# EAGLE design MDmotherboard (EAGLE 9.6.2)
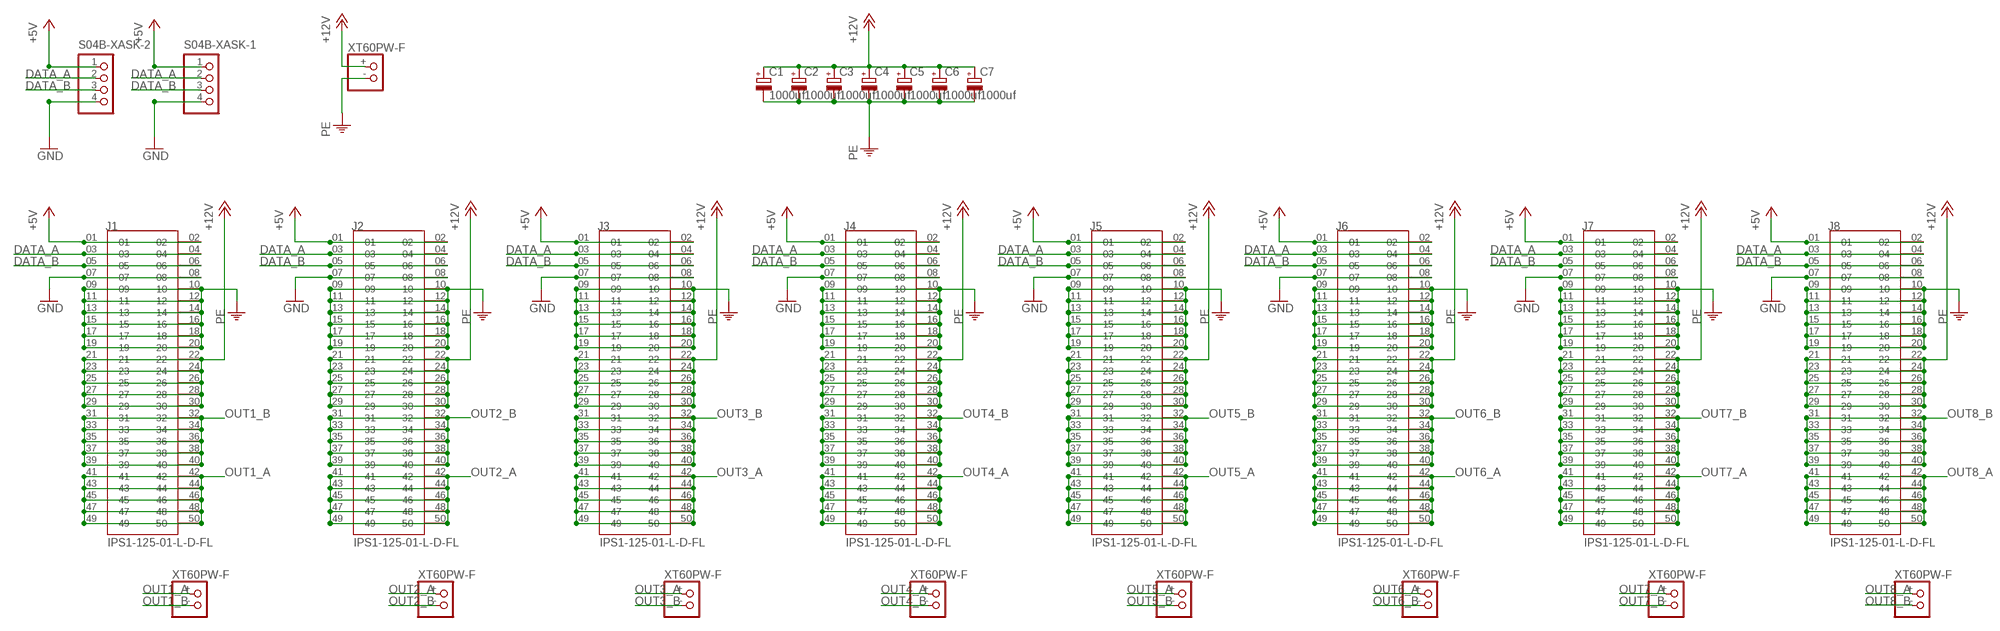
[diagram p0: schematic, sheet 1]

## Parts
C1  1000uf  CPOL-EUE3.5-10  [E3,5-10]
C2  1000uf  CPOL-EUE3.5-10  [E3,5-10]
C3  1000uf  CPOL-EUE3.5-10  [E3,5-10]
C4  1000uf  CPOL-EUE3.5-10  [E3,5-10]
C5  1000uf  CPOL-EUE3.5-10  [E3,5-10]
C6  1000uf  CPOL-EUE3.5-10  [E3,5-10]
C7  1000uf  CPOL-EUE3.5-10  [E3,5-10]
J1  IPS1-125-01-L-D-FL  [SAMTEC_IPS1-125-01-L-D-FL]
J2  IPS1-125-01-L-D-FL  [SAMTEC_IPS1-125-01-L-D-FL]
J3  IPS1-125-01-L-D-FL  [SAMTEC_IPS1-125-01-L-D-FL]
J4  IPS1-125-01-L-D-FL  [SAMTEC_IPS1-125-01-L-D-FL]
J5  IPS1-125-01-L-D-FL  [SAMTEC_IPS1-125-01-L-D-FL]
J6  IPS1-125-01-L-D-FL  [SAMTEC_IPS1-125-01-L-D-FL]
J7  IPS1-125-01-L-D-FL  [SAMTEC_IPS1-125-01-L-D-FL]
J8  IPS1-125-01-L-D-FL  [SAMTEC_IPS1-125-01-L-D-FL]
S04B-XASK-1  S4B-XASK-1  [S4B-XASK-1]
S04B-XASK-2  S4B-XASK-1  [S4B-XASK-1]
U$1  XT60PW-F  [XT60PW-F]
U$2  XT60PW-F  [XT60PW-F]
U$3  XT60PW-F  [XT60PW-F]
U$4  XT60PW-F  [XT60PW-F]
U$5  XT60PW-F  [XT60PW-F]
U$6  XT60PW-F  [XT60PW-F]
U$7  XT60PW-F  [XT60PW-F]
U$8  XT60PW-F  [XT60PW-F]
U$9  XT60PW-F  [XT60PW-F]

## Nets
+5V: J1.01 J1.02 J2.01 J2.02 J3.01 J3.02 J4.01 J4.02 J5.01 J5.02 J6.01 J6.02 J7.01 J7.02 J8.01 J8.02 S04B-XASK-1.1 S04B-XASK-2.1
+12V: C1.+ C2.+ C3.+ C4.+ C5.+ C6.+ C7.+ J1.21 J1.22 J1.23 J1.24 J1.25 J1.26 J1.27 J1.28 J1.29 J1.30 J2.21 J2.22 J2.23 J2.24 J2.25 J2.26 J2.27 J2.28 J2.29 J2.30 J3.21 J3.22 J3.23 J3.24 J3.25 J3.26 J3.27 J3.28 J3.29 J3.30 J4.21 J4.22 J4.23 J4.24 J4.25 J4.26 J4.27 J4.28 J4.29 J4.30 J5.21 J5.22 J5.23 J5.24 J5.25 J5.26 J5.27 J5.28 J5.29 J5.30 J6.21 J6.22 J6.23 J6.24 J6.25 J6.26 J6.27 J6.28 J6.29 J6.30 J7.21 J7.22 J7.23 J7.24 J7.25 J7.26 J7.27 J7.28 J7.29 J7.30 J8.21 J8.22 J8.23 J8.24 J8.25 J8.26 J8.27 J8.28 J8.29 J8.30 U$1.+
DATA_A: J1.03 J1.04 J2.03 J2.04 J3.03 J3.04 J4.03 J4.04 J5.03 J5.04 J6.03 J6.04 J7.03 J7.04 J8.03 J8.04 S04B-XASK-1.2 S04B-XASK-2.2
DATA_B: J1.05 J1.06 J2.05 J2.06 J3.05 J3.06 J4.05 J4.06 J5.05 J5.06 J6.05 J6.06 J7.05 J7.06 J8.05 J8.06 S04B-XASK-1.3 S04B-XASK-2.3
GND: J1.07 J1.08 J2.07 J2.08 J3.07 J3.08 J4.07 J4.08 J5.07 J5.08 J6.07 J6.08 J7.07 J7.08 J8.07 J8.08 S04B-XASK-1.4 S04B-XASK-2.4
OUT1_A: J1.41 J1.42 J1.43 J1.44 J1.45 J1.46 J1.47 J1.48 J1.49 J1.50 U$2.+
OUT1_B: J1.31 J1.32 J1.33 J1.34 J1.35 J1.36 J1.37 J1.38 J1.39 J1.40 U$2.-
OUT2_A: J2.41 J2.42 J2.43 J2.44 J2.45 J2.46 J2.47 J2.48 J2.49 J2.50 U$3.+
OUT2_B: J2.31 J2.32 J2.33 J2.34 J2.35 J2.36 J2.37 J2.38 J2.39 J2.40 U$3.-
OUT3_A: J3.41 J3.42 J3.43 J3.44 J3.45 J3.46 J3.47 J3.48 J3.49 J3.50 U$4.+
OUT3_B: J3.31 J3.32 J3.33 J3.34 J3.35 J3.36 J3.37 J3.38 J3.39 J3.40 U$4.-
OUT4_A: J4.41 J4.42 J4.43 J4.44 J4.45 J4.46 J4.47 J4.48 J4.49 J4.50 U$5.+
OUT4_B: J4.31 J4.32 J4.33 J4.34 J4.35 J4.36 J4.37 J4.38 J4.39 J4.40 U$5.-
OUT5_A: J5.41 J5.42 J5.43 J5.44 J5.45 J5.46 J5.47 J5.48 J5.49 J5.50 U$6.+
OUT5_B: J5.31 J5.32 J5.33 J5.34 J5.35 J5.36 J5.37 J5.38 J5.39 J5.40 U$6.-
OUT6_A: J6.41 J6.42 J6.43 J6.44 J6.45 J6.46 J6.47 J6.48 J6.49 J6.50 U$7.+
OUT6_B: J6.31 J6.32 J6.33 J6.34 J6.35 J6.36 J6.37 J6.38 J6.39 J6.40 U$7.-
OUT7_A: J7.41 J7.42 J7.43 J7.44 J7.45 J7.46 J7.47 J7.48 J7.49 J7.50 U$8.+
OUT7_B: J7.31 J7.32 J7.33 J7.34 J7.35 J7.36 J7.37 J7.38 J7.39 J7.40 U$8.-
OUT8_A: J8.41 J8.42 J8.43 J8.44 J8.45 J8.46 J8.47 J8.48 J8.49 J8.50 U$9.+
OUT8_B: J8.31 J8.32 J8.33 J8.34 J8.35 J8.36 J8.37 J8.38 J8.39 J8.40 U$9.-
PE: C1.- C2.- C3.- C4.- C5.- C6.- C7.- J1.09 J1.10 J1.11 J1.12 J1.13 J1.14 J1.15 J1.16 J1.17 J1.18 J1.19 J1.20 J2.09 J2.10 J2.11 J2.12 J2.13 J2.14 J2.15 J2.16 J2.17 J2.18 J2.19 J2.20 J3.09 J3.10 J3.11 J3.12 J3.13 J3.14 J3.15 J3.16 J3.17 J3.18 J3.19 J3.20 J4.09 J4.10 J4.11 J4.12 J4.13 J4.14 J4.15 J4.16 J4.17 J4.18 J4.19 J4.20 J5.09 J5.10 J5.11 J5.12 J5.13 J5.14 J5.15 J5.16 J5.17 J5.18 J5.19 J5.20 J6.09 J6.10 J6.11 J6.12 J6.13 J6.14 J6.15 J6.16 J6.17 J6.18 J6.19 J6.20 J7.09 J7.10 J7.11 J7.12 J7.13 J7.14 J7.15 J7.16 J7.17 J7.18 J7.19 J7.20 J8.09 J8.10 J8.11 J8.12 J8.13 J8.14 J8.15 J8.16 J8.17 J8.18 J8.19 J8.20 U$1.-

## Library data of the parts
C1-C7 = rcl:CPOL-EU: POLARIZED CAPACITOR, European symbol; SPICEPREFIX: C
J1-J8 = IPS1-125-01-L-D-FL:IPS1-125-01-L-D-FL: Check availability <https://pricing.snapeda.com/parts/IPS1-125-01-L-D-FL/Samtec%20Inc./view-part?ref=eda>; AVAILABILITY: In Stock; DESCRIPTION: 50 Position Receptacle Connector 0.100 (2.54mm) Through Hole Gold; MF: Samtec Inc.; MP: IPS1-125-01-L-D-FL; PACKAGE: None; PRICE: None; PURCHASE-URL: https://pricing.snapeda.com/search/part/IPS1-125-01-L-D-FL/?ref=eda
S04B-XASK-1 S04B-XASK-2 = XAconnecter:S4B-XASK-1: Wire-to-Board 2.5mm pitch top mount connector Source: http://www.jst-mfg.com/product/pdf/jpn/XA1.pdf http://www.jst-mfg.com/product/detail.php?series=272
U$1-U$9 = XT60_s:XT60PW-F

## Board
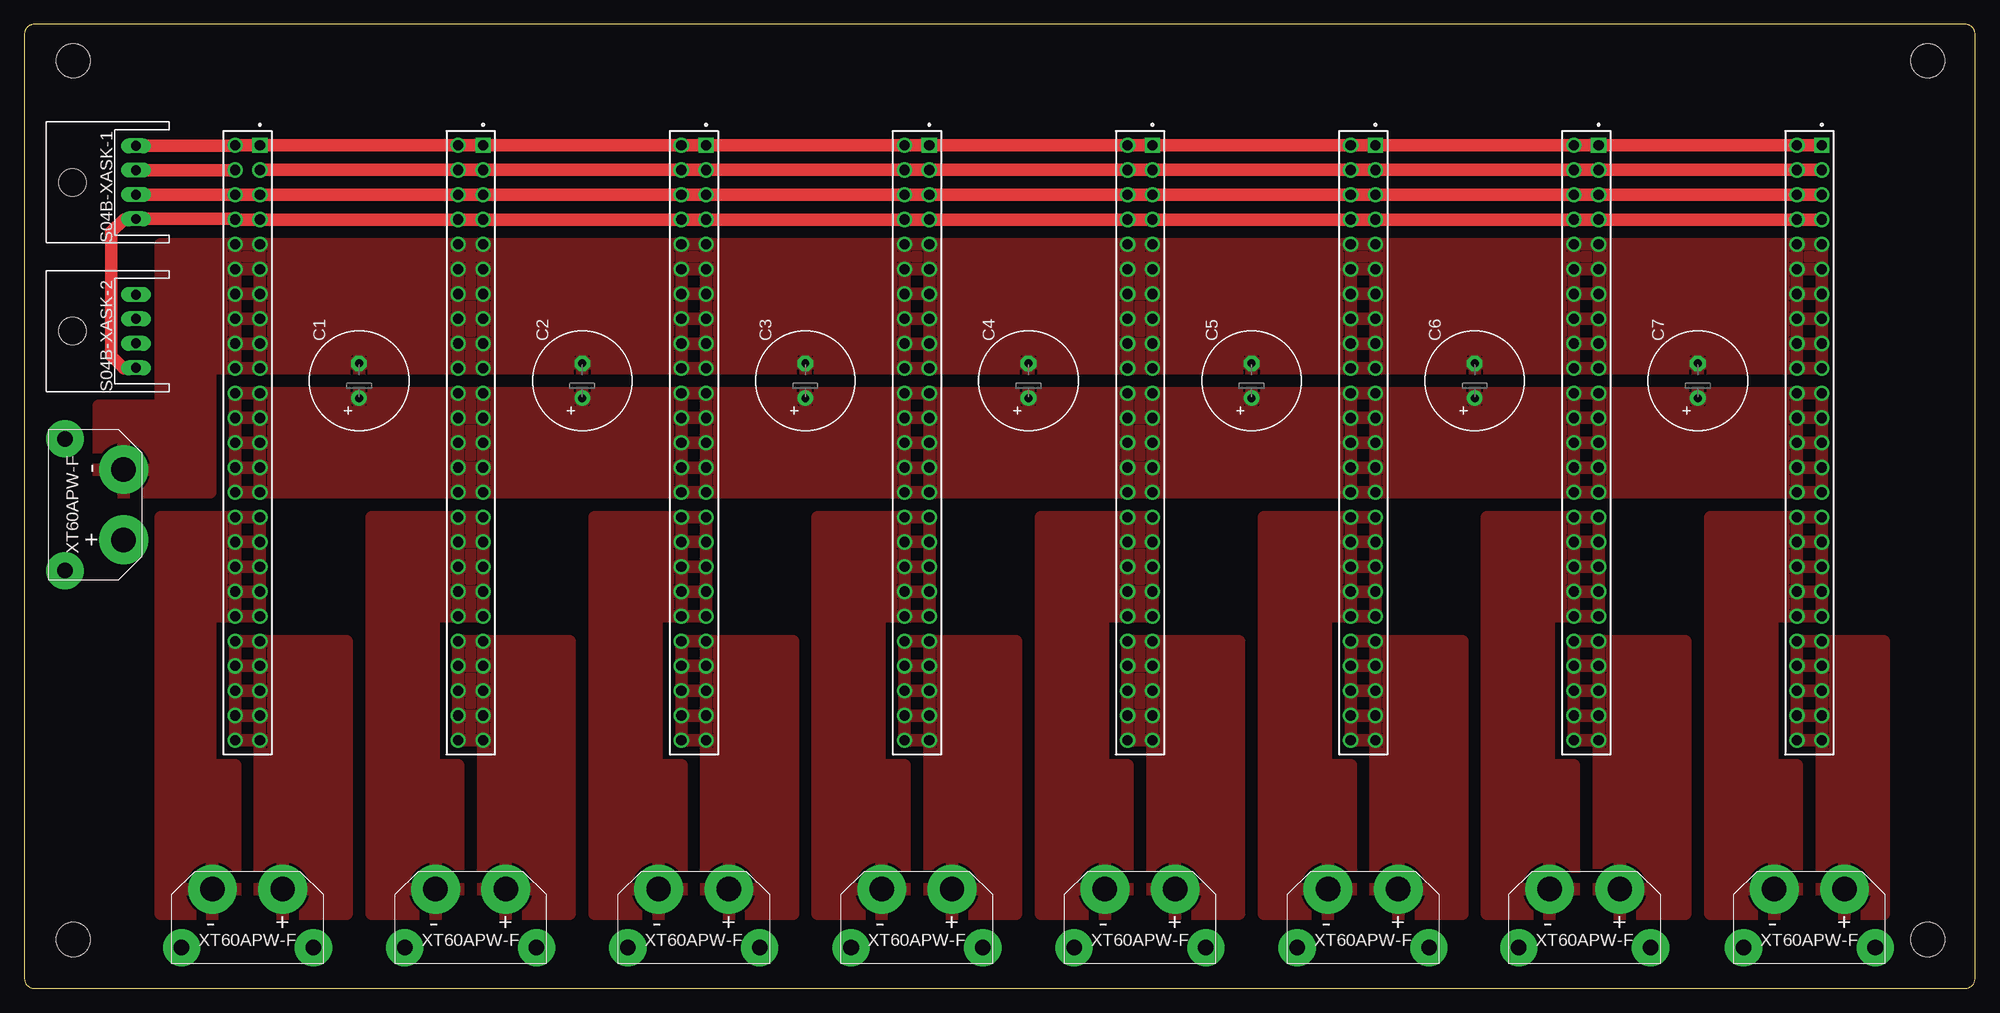
[diagram p1: board, top side]
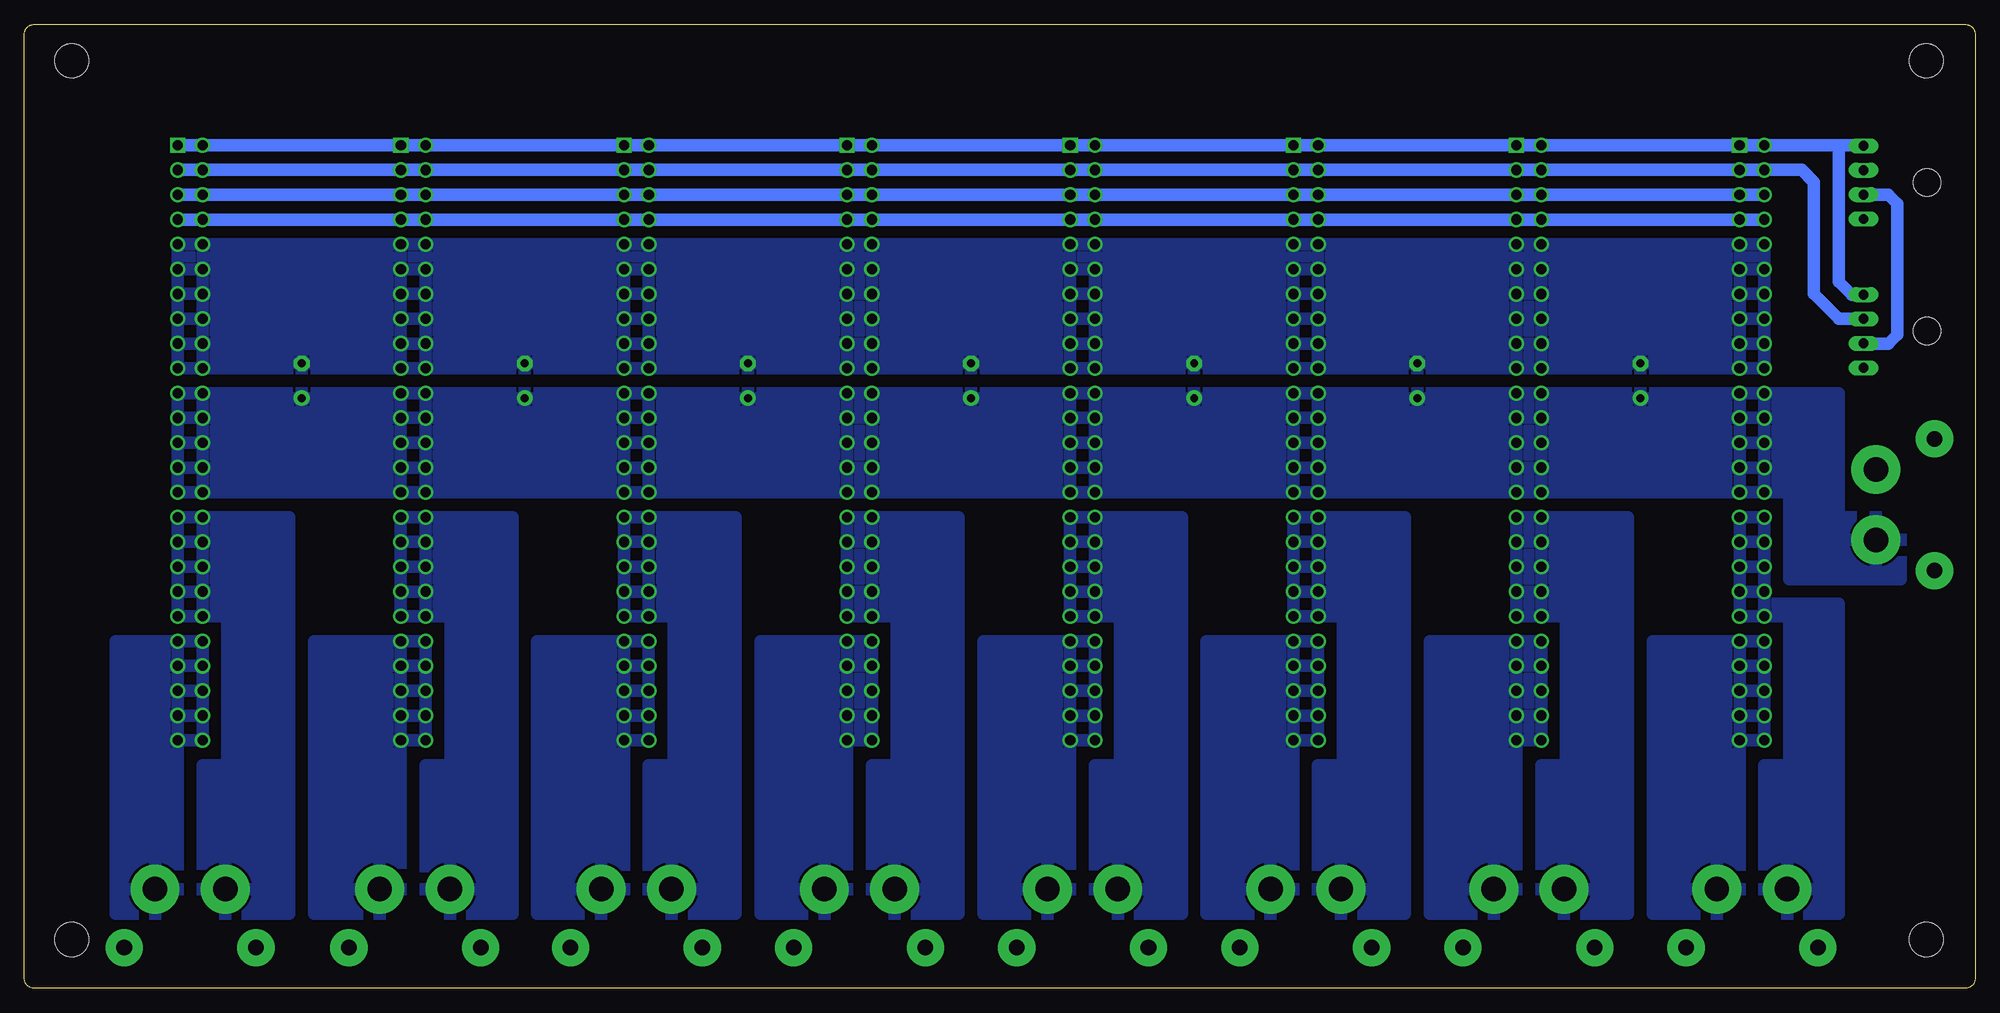
[diagram p2: board, bottom side, seen from below]

Size 199.86 x 98.73 mm. Coordinates in mm from the lower left corner, seen from the top.
Outline: 199.86,1 199.86,97.73 arc90 198.86,98.73 1,98.73 arc90 0,97.73 0,1 arc90 1,0 198.86,0 arc90 199.86,1
Copper layers (1*16): Top 0.035mm / dielectric 1.5mm / Bottom 0.035mm
Design rules "default": minimum track width 6mil, minimum drill 0.35mm, track to track 6mil, track to pad 6mil, pad to pad 6mil, via to via 6mil, smd to smd 6mil, copper to edge 40mil, drill to drill 6mil, minimum pad ring 10mil, minimum via ring 8mil, stop-mask expansion 4mil, vias tented up to drill 0mil, thermal gap 10mil
Holes 3.5 mm at 5,5 5,95 195,5 195,95

### Footprints (pad centres in the part's own frame; a part is rotated, then mirrored left to right if it is on the bottom)
E3,5-10 = drill 0.813 pad 1.6: + -1.778,0 | drill 0.813 pad 1.6 octagon: - 1.778,0
SAMTEC_IPS1-125-01-L-D-FL = drill 1.04 pad 1.39 square: 01 30.48,-1.27 | drill 1.04 pad 1.39: 02 30.48,1.27; 03 27.94,-1.27; 04 27.94,1.27; 05 25.4,-1.27; 06 25.4,1.27; 07 22.86,-1.27; 08 22.86,1.27; 09 20.32,-1.27; 10 20.32,1.27; 11 17.78,-1.27; 12 17.78,1.27; 13 15.24,-1.27; 14 15.24,1.27; 15 12.7,-1.27; 16 12.7,1.27; 17 10.16,-1.27; 18 10.16,1.27; 19 7.62,-1.27; 20 7.62,1.27; 21 5.08,-1.27; 22 5.08,1.27; 23 2.54,-1.27; 24 2.54,1.27; 25 0,-1.27; 26 0,1.27; 27 -2.54,-1.27; 28 -2.54,1.27; 29 -5.08,-1.27; 30 -5.08,1.27; 31 -7.62,-1.27; 32 -7.62,1.27; 33 -10.16,-1.27; 34 -10.16,1.27; 35 -12.7,-1.27; 36 -12.7,1.27; 37 -15.24,-1.27; 38 -15.24,1.27; 39 -17.78,-1.27; 40 -17.78,1.27; 41 -20.32,-1.27; 42 -20.32,1.27; 43 -22.86,-1.27; 44 -22.86,1.27; 45 -25.4,-1.27; 46 -25.4,1.27; 47 -27.94,-1.27; 48 -27.94,1.27; 49 -30.48,-1.27; 50 -30.48,1.27
S4B-XASK-1 = drill 1.016 long: 1 3.75,0; 2 1.25,0; 3 -1.25,0; 4 -3.75,0 | hole 2.8: 0,6.5
XT60PW-F = drill 1.6 pad 3.81: 1 -6.75,6; 2 6.75,6 | drill 2.5 pad 5: + -3.6,0; - 3.6,0

### Placement (x,y rotation side)
C1  34.29,62.23 90 top
C2  57.15,62.23 90 top
C3  80.01,62.23 90 top
C4  102.87,62.23 90 top
C5  125.73,62.23 90 top
C6  148.59,62.23 90 top
C7  171.45,62.23 90 top
J1  22.86,55.88 90 top
J2  45.72,55.88 90 top
J3  68.58,55.88 90 top
J4  91.44,55.88 90 top
J5  114.3,55.88 90 top
J6  137.16,55.88 90 top
J7  160.02,55.88 90 top
J8  182.88,55.88 90 top
S04B-XASK-1  11.43,82.55 90 top
S04B-XASK-2  11.43,67.31 90 top
U$1  10.16,49.53 90 top
U$2  22.86,10.16 180 top
U$3  45.72,10.16 180 top
U$4  68.58,10.16 180 top
U$5  91.44,10.16 180 top
U$6  114.3,10.16 180 top
U$7  137.16,10.16 180 top
U$8  159.86,10.16 180 top
U$9  182.88,10.16 180 top

### Tracks (layer width: path | path; a pad name or v marks a point on that pad's centre or on a via)
+5V
  Top 1.27: J7.02 J8.01 J8.02 | J7.02 J6.02 | J6.02 J5.02 | J5.02 J4.02 | J4.02 J3.01 | J3.01 J2.01 J2.02 J1.01 J1.02 21.53,86.3 S04B-XASK-1.1 | J3.02 J3.01 | J7.01 J7.02 | J6.01 J6.02 | J5.01 J5.02 | J4.01 J4.02
  Bottom 1.27: 13.97,86.36 13.97,72.39 12.64,71.06 S04B-XASK-2.1 | J8.01 J1.02 13.97,86.36 | 13.97,86.36 11.43,86.36 S04B-XASK-1.1
+12V
  pour Top: 21.59,50.8 184.15,50.8 184.15,60.96 21.59,60.96
  pour Bottom: 21.59,60.96 13.97,60.96 13.97,49.53 13.97,48.26 7.62,48.26 7.62,41.91 19.05,41.91 19.05,50.8 184.15,50.8 184.15,60.96
DATA_A
  Top 1.27: J7.04 J8.03 J8.04 | J7.04 J6.04 | J6.04 J5.04 | J5.04 J4.04 | J4.04 J3.03 | J3.03 J2.03 J2.04 J1.03 | J1.04 21.57,83.8 S04B-XASK-1.2 | J3.04 J3.03 | J7.03 J7.04 | J6.03 J6.04 | J5.03 J5.04 | J4.03 J4.04
  Bottom 1.27: S04B-XASK-2.2 11.45,68.58 13.97,68.58 16.51,71.12 16.51,82.55 17.78,83.82 J1.04 J1.03 J8.03
DATA_B
  Top 1.27: J7.06 J8.05 J8.06 | J7.06 J6.06 | J6.06 J5.06 | J5.06 J4.06 | J4.06 J3.05 | J3.05 J2.05 J2.06 J1.05 J1.06 21.57,81.3 S04B-XASK-1.3 | J3.06 J3.05 | J7.05 J7.06 | J6.05 J6.06 | J5.05 J5.06 | J4.05 J4.06
  Bottom 1.27: S04B-XASK-2.3 11.41,66.04 8.89,66.04 7.98,66.95 7.98,80.37 8.91,81.3 S04B-XASK-1.3 | J8.05 J1.06
GND
  Top 1.27: J1.08 21.65,78.8 | J1.08 21.53,78.8 S04B-XASK-1.4 11.37,78.74 10.16,78.74 8.89,77.47 8.89,64.77 10.16,63.5 11.49,63.5 S04B-XASK-2.4 | J1.08 J1.07 J2.08 J2.07 J3.08 J3.07 J4.08 J4.07 J5.08 J5.07 J6.08 J6.07 J7.08 J7.07 J8.08 J8.07
  Bottom 1.27: J1.08 J8.07
OUT1_A
  pour Top: 24.13,7.62 33.02,7.62 33.02,35.56 21.59,35.56 21.59,25.4 24.13,25.4
  pour Bottom: 21.59,35.56 21.59,25.4 24.13,25.4 24.13,7.62 33.02,7.62 33.02,35.56
OUT1_B
  pour Top: 24.13,48.26 13.97,48.26 13.97,7.62 21.59,7.62 21.59,22.86 19.05,22.86 19.05,38.1 24.13,38.1
  pour Bottom: 21.59,48.26 24.13,48.26 24.13,38.1 19.05,38.1 19.05,22.86 21.59,22.86 21.59,7.62 13.97,7.62 13.97,39.37 21.59,39.37
OUT2_A
  pour Top: 44.45,35.56 44.45,25.4 46.99,25.4 46.99,7.62 55.88,7.62 55.88,34.29 55.88,35.56
  pour Bottom: 44.45,35.56 44.45,25.4 46.99,25.4 46.99,7.62 55.88,7.62 55.88,35.56
OUT2_B
  pour Top: 44.45,7.62 35.56,7.62 35.56,48.26 46.99,48.26 46.99,38.1 41.91,38.1 41.91,22.86 44.45,22.86
  pour Bottom: 46.99,38.1 41.91,38.1 41.91,22.86 44.45,22.86 44.45,7.62 35.56,7.62 35.56,48.26 46.99,48.26
OUT3_A
  pour Top: 67.31,35.56 67.31,25.4 69.85,25.4 69.85,7.62 78.74,7.62 78.74,35.56
  pour Bottom: 69.85,7.62 69.85,25.4 67.31,25.4 67.31,35.56 78.74,35.56 78.74,7.62
OUT3_B
  pour Top: 69.85,38.1 64.77,38.1 64.77,22.86 67.31,22.86 67.31,7.62 58.42,7.62 58.42,48.26 69.85,48.26
  pour Bottom: 67.31,7.62 67.31,22.86 64.77,22.86 64.77,38.1 69.85,38.1 69.85,48.26 58.42,48.26 58.42,7.62
OUT4_A
  pour Top: 90.17,35.56 90.17,25.4 92.71,25.4 92.71,7.62 101.6,7.62 101.6,35.56
  pour Bottom: 90.17,35.56 90.17,25.4 92.71,25.4 92.71,7.62 101.6,7.62 101.6,35.56
OUT4_B
  pour Top: 92.71,38.1 87.63,38.1 87.63,22.86 90.17,22.86 90.17,7.62 81.28,7.62 81.28,48.26 92.71,48.26
  pour Bottom: 92.71,38.1 87.63,38.1 87.63,22.86 90.17,22.86 90.17,7.62 81.28,7.62 81.28,48.26 92.71,48.26
OUT5_A
  pour Top: 113.03,35.56 113.03,25.4 115.57,25.4 115.57,7.62 124.46,7.62 124.46,35.56
  pour Bottom: 113.03,34.29 113.03,35.56 124.46,35.56 124.46,7.62 115.57,7.62 115.57,25.4 113.03,25.4
OUT5_B
  pour Top: 115.57,38.1 110.49,38.1 110.49,22.86 113.03,22.86 113.03,7.62 104.14,7.62 104.14,48.26 115.57,48.26
  pour Bottom: 115.57,38.1 110.49,38.1 110.49,22.86 113.03,22.86 113.03,7.62 104.14,7.62 104.14,48.26 115.57,48.26
OUT6_A
  pour Bottom: 138.43,25.4 135.89,25.4 135.89,35.56 147.32,35.56 147.32,7.62 138.43,7.62
  pour Top: 135.89,25.4 138.43,25.4 138.43,7.62 147.32,7.62 147.32,35.56 135.89,35.56
OUT6_B
  pour Bottom: 138.43,38.1 133.35,38.1 133.35,22.86 135.89,22.86 135.89,7.62 127,7.62 127,48.26 138.43,48.26
  pour Top: 138.43,48.26 127,48.26 127,7.62 135.89,7.62 135.89,22.86 133.35,22.86 133.35,38.1 138.43,38.1
OUT7_A
  pour Top: 158.75,35.56 158.75,25.4 161.29,25.4 161.29,7.62 170.18,7.62 170.18,35.56
  pour Bottom: 158.75,35.56 158.75,25.4 161.29,25.4 161.29,7.62 170.18,7.62 170.18,35.56
OUT7_B
  pour Top: 161.29,38.1 156.21,38.1 156.21,22.86 158.75,22.86 158.75,7.62 149.86,7.62 149.86,48.26 161.29,48.26
  pour Bottom: 161.29,38.1 156.21,38.1 156.21,22.86 158.75,22.86 158.75,7.62 149.86,7.62 149.86,48.26 161.29,48.26
OUT8_A
  pour Bottom: 181.61,35.56 181.61,25.4 184.15,25.4 184.15,7.62 190.5,7.62 190.5,35.56
  pour Top: 181.61,35.56 181.61,25.4 184.15,25.4 184.15,7.62 190.5,7.62 190.5,35.56
OUT8_B
  pour Bottom: 184.15,38.1 179.07,38.1 179.07,22.86 181.61,22.86 181.61,7.62 172.72,7.62 172.72,48.26 184.15,48.26
  pour Top: 184.15,38.1 179.07,38.1 179.07,22.86 181.61,22.86 181.61,7.62 172.72,7.62 172.72,48.26 184.15,48.26
PE
  pour Top: 21.59,63.5 184.15,63.5 184.15,73.66 184.15,76.2 21.59,76.2
  pour Top: 7.62,59.69 7.62,50.8 19.05,50.8 19.05,63.5 24.13,63.5 24.13,76.2 15.24,76.2 13.97,76.2 13.97,59.69
  pour Bottom: 21.59,63.5 184.15,63.5 184.15,74.93 184.15,76.2 21.59,76.2